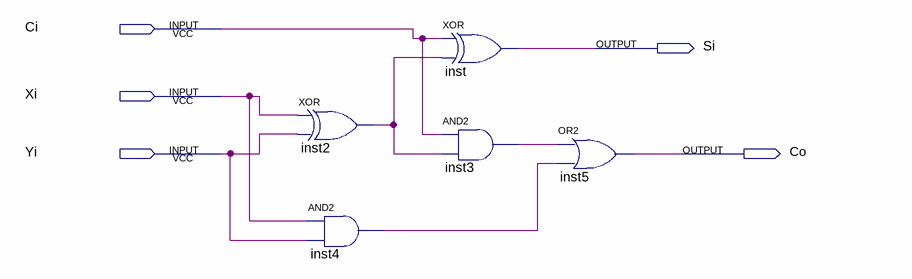
[diagram p0: schematic sheet]
// Quartus schematic aula05.bdf as structural Verilog: 5 symbols, 5 pins
module aula05 (
  input  Ci,
  input  Xi,
  input  Yi,
  output Si,
  output Co
);

  wire inst2_out, inst3_out, inst4_out;

  xor inst2 (inst2_out, Xi, Yi);
  and inst4 (inst4_out, Xi, Yi);
  xor inst (Si, Ci, inst2_out);
  and inst3 (inst3_out, Ci, inst2_out);
  or inst5 (Co, inst3_out, inst4_out);
endmodule
